# EAGLE design telem_board (EAGLE 6.5.0)
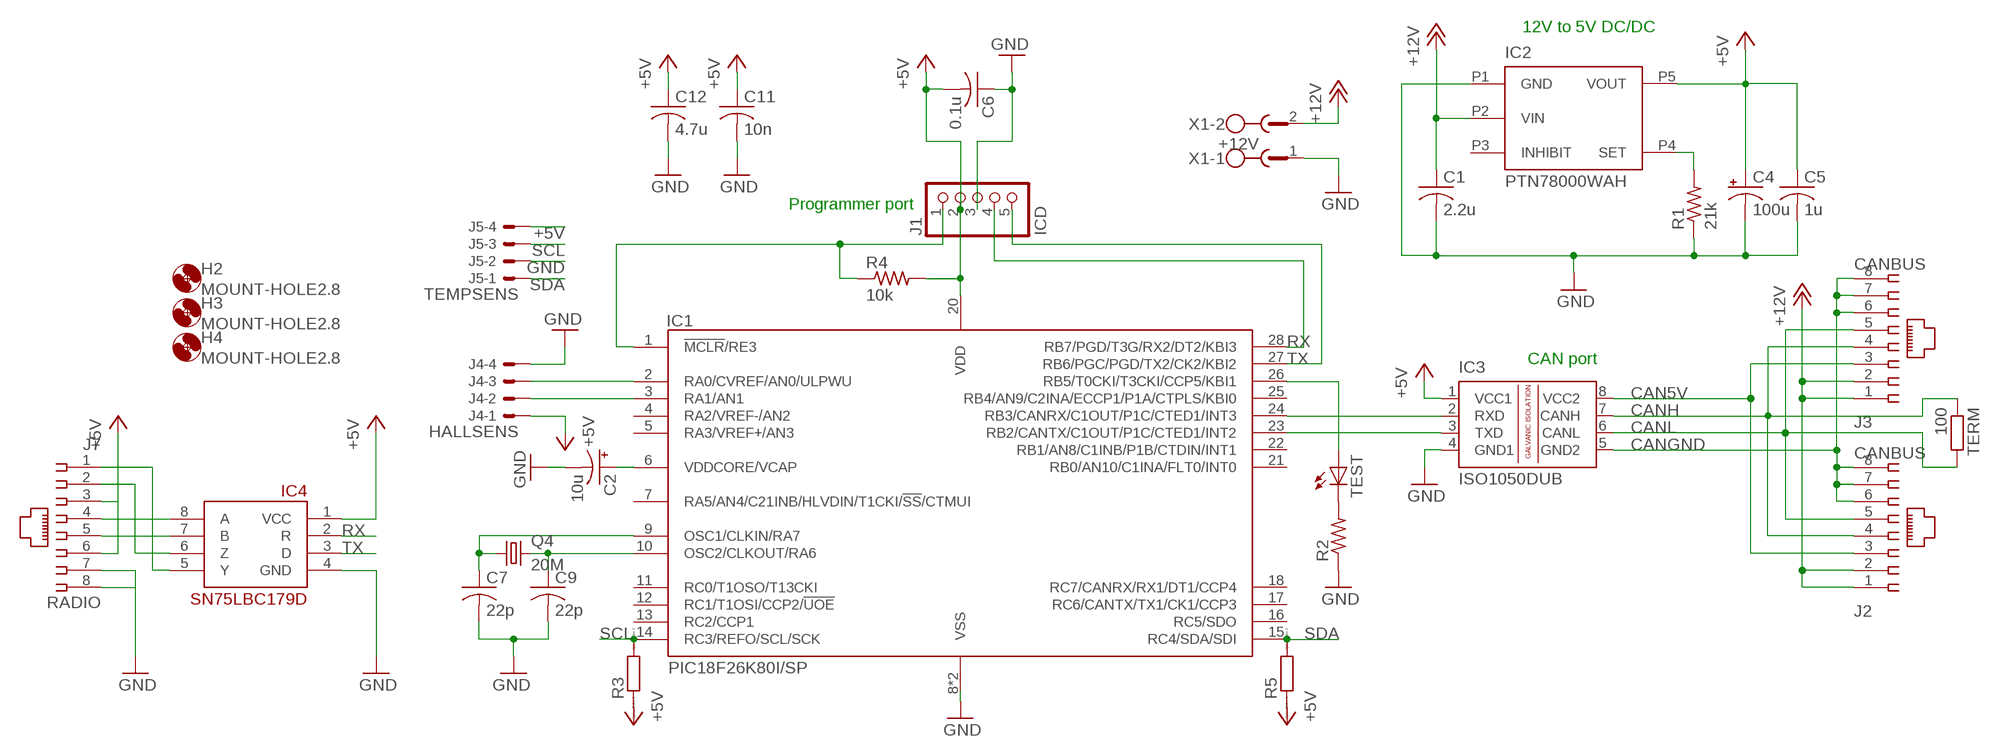
[diagram p0: schematic, sheet 1]

## Parts
C1  2.2u  C-USC1206  [C1206]
C2  10u  CPOL-USTT2D4  [TT2D4]
C4  100u  CPOL-USSMCD  [SMC_D]
C5  1u  C-USC0805  [C0805]
C6  0.1u  C-USC0805  [C0805]
C7  22p  C-USC0805  [C0805]
C9  22p  C-USC0805  [C0805]
C11  10n  C-USC0805  [C0805]
C12  4.7u  C-USC0805  [C0805]
H2  MOUNT-HOLE2.8  [2,8]
H3  MOUNT-HOLE2.8  [2,8]
H4  MOUNT-HOLE2.8  [2,8]
IC1  PIC18F26K80I/SP  [DIL28/3]
IC2  PTN78000WAH  [PTN78000]
IC3  ISO1050DUB  [DUB-R-PDSO-G8]
IC4  SN75LBC179D  [SO08]
J1  ICD  PINHD-1X5  [1X05]
J2  CANBUS  215877-7  [215877-7]
J3  CANBUS  215877-7  [215877-7]
J4  HALLSENS  22-27-2041-04  [6410-04]
J5  TEMPSENS  22-27-2041-04  [6410-04]
J7  RADIO  215877-7  [215877-7]
Q4  20M  CRYSTALHC49S  [HC49/S]
R1  21k  R-US_R0805  [R0805]
R2  R-US_R0805  [R0805]
R3  R  [R0805]
R4  10k  R-US_R0805  [R0805]
R5  R  [R0805]
TERM  100  R-EU_0207/10  [0207/10]
TEST  LED5MM  [LED5MM]
X1  +12V  MSTBA2  [MSTBA2]

## Nets
+5V: C4.+ C5.1 C6.2 C11.1 C12.1 IC1.20(VDD) IC2.P5(VOUT) IC3.1(VCC1) IC4.1(VCC) J1.2 J4.1 J5.4 J7.3 J7.6 R3.1 R4.2 R5.1
+12V: C1.1 IC2.P2(VIN) J2.1 J2.2 J3.1 J3.2 X1.2
CAN5V: IC3.8(VCC2) J2.3 J3.3
CANGND: IC3.5(GND2) J2.6 J2.7 J2.8 J3.6 J3.7 J3.8
CANH: IC3.7(CANH) J2.4 J3.4 TERM.1
CANL: IC3.6(CANL) J2.5 J3.5 TERM.2
GND: C1.2 C2.- C4.- C5.2 C6.1 C7.2 C9.2 C11.2 C12.2 IC1.8(VSS) IC1.19(VSS) IC2.P1(GND) IC3.4(GND1) IC4.4(GND) J1.3 J4.4 J5.2 J7.7 J7.8 R1.1 R2.1 X1.1
N$1: IC1.2(RA0/CVREF/AN0/ULPWU) J4.3
N$2: IC1.3(RA1/AN1) J4.2
N$3: IC4.7(B) J7.5
N$4: IC4.8(A) J7.4
N$5: C2.+ IC1.6(VDDCORE/VCAP)
N$6: IC1.23(RB2/CANTX/C1OUT/P1C/CTED1/INT2) IC3.3(TXD)
N$7: R2.2 TEST.K(C)
N$8: IC2.P4(SET) R1.2
N$9: IC1.24(RB3/CANRX/C1OUT/P1C/CTED1/INT3) IC3.2(RXD)
N$10: IC4.6(Z) J7.2
N$11: IC1.26(RB5/T0CKI/T3CKI/CCP5/KBI1) TEST.A
N$12: IC4.5(Y) J7.1
N$20: IC1.1(!MCLR!/RE3) J1.1 R4.1
N$24: C7.1 IC1.9(OSC1/CLKIN/RA7) Q4.1
N$25: C9.1 IC1.10(OSC2/CLKOUT/RA6) Q4.2
RX: IC1.28(RB7/PGD/T3G/RX2/DT2/KBI3) IC4.2(R) J1.4
SCL: IC1.14(RC3/REFO/SCL/SCK) J5.3 R3.2
SDA: IC1.15(RC4/SDA/SDI) J5.1 R5.2
TX: IC1.27(RB6/PGC/PGD/TX2/CK2/KBI2) IC4.3(D) J1.5
Unconnected: IC1.4(RA2/VREF-/AN2) IC1.5(RA3/VREF+/AN3) IC1.7(RA5/AN4/C21INB/HLVDIN/T1CKI/!SS!/CTMUI) IC1.11(RC0/T1OSO/T13CKI) IC1.12(RC1/T1OSI/CCP2/!UOE!) IC1.13(RC2/CCP1) IC1.16(RC5/SDO) IC1.17(RC6/CANTX/TX1/CK1/CCP3) IC1.18(RC7/CANRX/RX1/DT1/CCP4) IC1.21(RB0/AN10/C1INA/FLT0/INT0) IC1.22(RB1/AN8/C1INB/P1B/CTDIN/INT1) IC1.25(RB4/AN9/C2INA/ECCP1/P1A/CTPLS/KBI0) IC2.P3(INHIBIT)

## Notes on the sheet
- 12V to 5V DC/DC
- Programmer port
- CAN port

## Library data of the parts
C1 C5-C7 C9 = rcl:C-US: CAPACITOR, American symbol
C2 C4 = rcl:CPOL-US: POLARIZED CAPACITOR, American symbol
C11 C12 = resistor:C-US: CAPACITOR, American symbol
H2-H4 = holes:MOUNT-HOLE: MOUNTING HOLE with drill center marker
IC1 = MSCP_2011_v2:PIC18F26K80
IC2 = MSCP_2011_v1:PTN78000WAH
IC3 = texas:ISO1050: ISOLATED CAN TRANSCEIVER Source: http://focus.ti.com/lit/ds/symlink/iso1050.pdf; MPN: ISO1050DUBR; OC_FARNELL: 1755712; OC_NEWARK: 14R9899
IC4 = MSCP_2011_v1:SN75LBC179
J1 = pinhead:PINHD-1X5: PIN HEADER
J2 J3 J7 = con-amp:215877-7: AMP connector
J4 J5 = con-molex:22-?-04: CONNECTOR wire to board 2.54 mm (.1 inch) pitch header; OC_FARNELL: unknown; OC_NEWARK: unknown
Q4 = crystal:CRYSTAL: CRYSTAL; OC_FARNELL: 1667008; OC_NEWARK: unknown
R1 R4 = rcl:R-US_: RESISTOR, American symbol
R2 = adafruit:R-US_: RESISTOR, American symbol
R3 R5 = eagle-ltspice:R: RESISTOR, European symbol; SPICEMODEL: NONE; SPICEPREFIX: R
TERM = resistor:R-EU_: RESISTOR, European symbol
TEST = led:LED: LED OSRAM: - CHIPLED LG R971, LG N971, LY N971, LG Q971, LY Q971, LO R971, LY R971 LH N974, LH R974 LS Q976, LO Q976, LY Q976 LO Q996 - Hyper CHIPLED LW Q18S LB Q993, LB Q99A, LB R99A - SideLED LS A670, LO A670, LY A670, LG A670, LP A670 LB A673, LV A673, LT A673, LW A673 LH A674 LY A675 LS A676, LA A676, LO A676, LY A676, LW A676 LS A679, LY A679, LG A679 - Hyper Micro SIDELED® LS Y876, LA Y876, LO Y876, LY Y876 LT Y87S - SmartLED LW L88C, LW L88S LB L89C, LB L89S, LG L890 LS L89K, LO L89K, LY L89K LS L896, LA L896, LO L896, LY L896 - TOPLED LS T670, LO T670, LY T670, LG T670, LP T670 LSG T670, LSP T670, LSY T670, LOP T670, LYG T670 LG T671, LOG T671, LSG T671 LB T673, LV T673, LT T673, LW T673 LH T674 LS T676, LA T676, LO T676, LY T676, LB T676, LH T676, LSB T676, LW T676 LB T67C, LV T67C, LT T67C, LS T67K, LO T67K, LY T67K, LW E67C LS E67B, LA E67B, LO E67B, LY E67B, LB E67C, LV E67C, LT E67C LW T67C LS T679, LY T679, LG T679 LS T770, LO T770, LY T770, LG T770, LP T770 LB T773, LV T773, LT T773, LW T773 LH T774 LS E675, LA E675, LY E675, LS T675 LS T776, LA T776, LO T776, LY T776, LB T776 LHGB T686 LT T68C, LB T68C - Hyper Mini TOPLED® LB M676 - Mini TOPLED Santana® LG M470 LS M47K, LO M47K, LY M47K Source: http://www.osram.convergy.de LUXEON: - LUMILED® LXK2-PW12-R00, LXK2-PW12-S00, LXK2-PW14-U00, LXK2-PW14-V00 LXK2-PM12-R00, LXK2-PM12-S00, LXK2-PM14-U00 LXK2-PE12-Q00, LXK2-PE12-R00, LXK2-PE12-S00, LXK2-PE14-T00, LXK2-PE14-U00 LXK2-PB12-K00, LXK2-PB12-L00, LXK2-PB12-M00, LXK2-PB14-N00, LXK2-PB14-P00, LXK2-PB14-Q00 LXK2-PR12-L00, LXK2-PR12-M00, LXK2-PR14-Q00, LXK2-PR14-R00 LXK2-PD12-Q00, LXK2-PD12-R00, LXK2-PD12-S00 LXK2-PH12-R00, LXK2-PH12-S00 LXK2-PL12-P00, LXK2-PL12-Q00, LXK2-PL12-R00 Source: www.luxeon.com KINGBRIGHT: KA-3528ASYC Source: www.kingbright.com
X1 = con-phoenix-508:MSTBA2: PHOENIX; MF: FARNELL; MPN: 1757242; OC_FARNELL: 3705171; OC_NEWARK: 71C4161

## Board
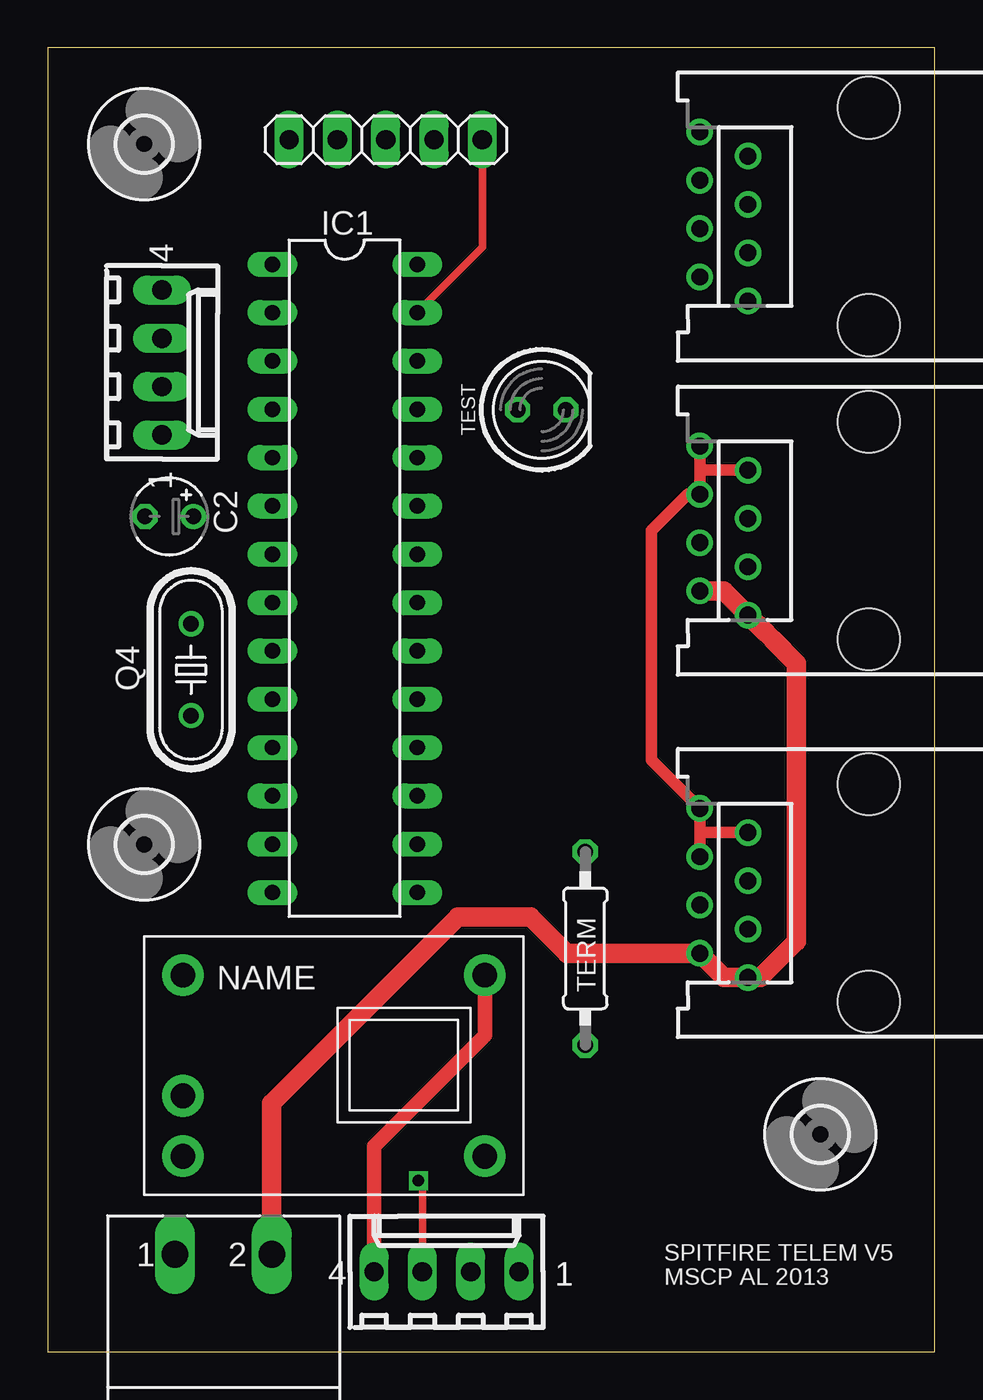
[diagram p1: board, top side]
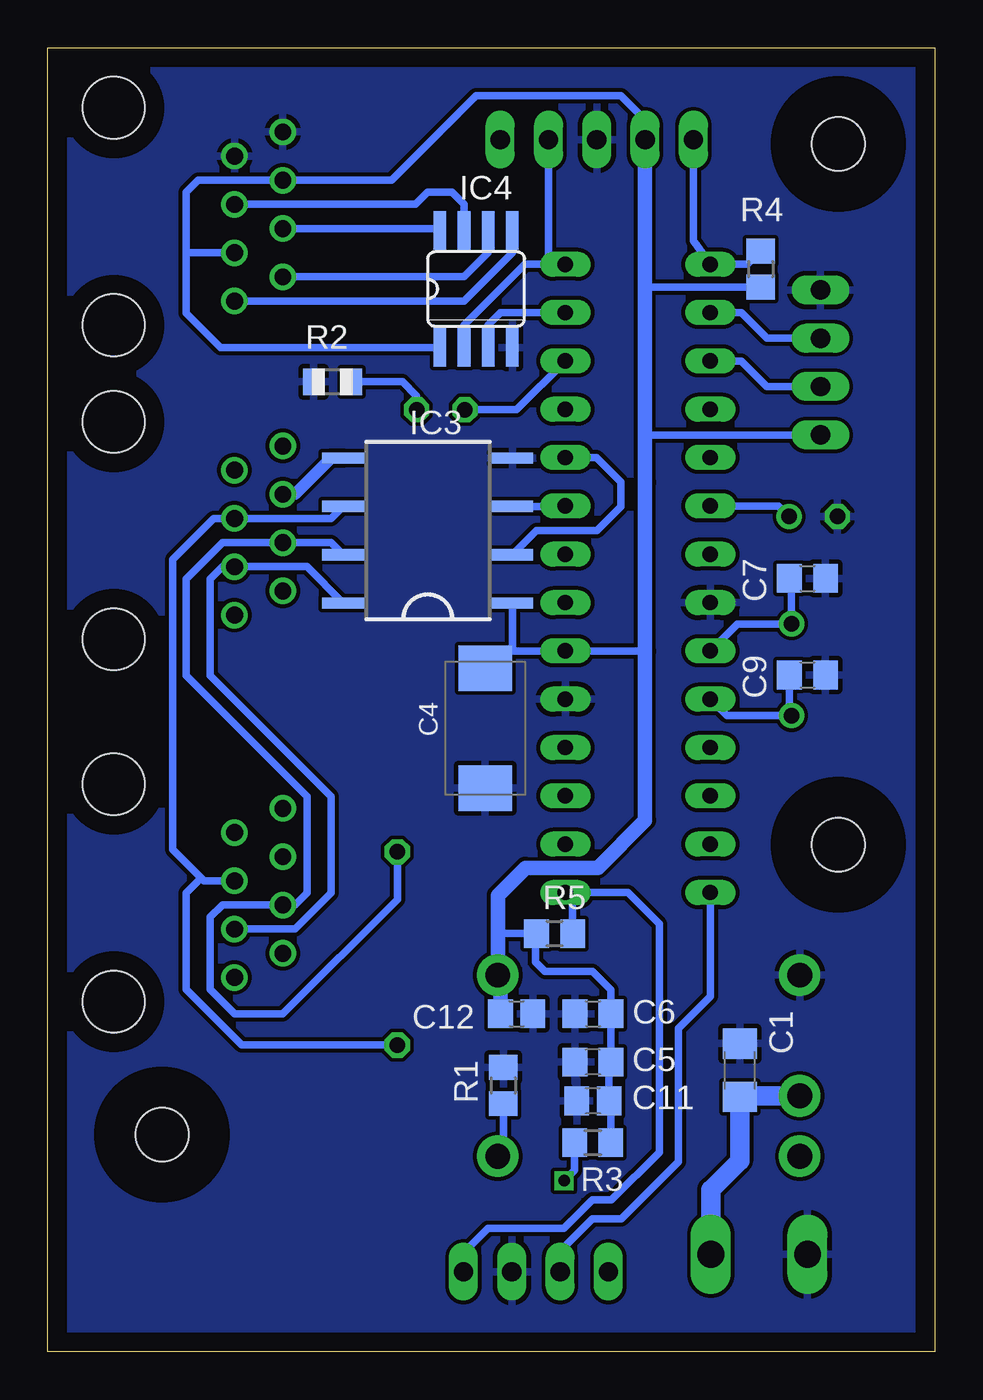
[diagram p2: board, bottom side, seen from below]

Size 46.66 x 68.57 mm. Coordinates in mm from the lower left corner, seen from the top.
Outline: 0,0 46.66,0 46.66,68.57 0,68.57 0,0
Copper layers (1*16): Top 0.035mm / dielectric 1.5mm / Bottom 0.035mm
Design rules "default": minimum track width 10mil, minimum drill 24mil, track to track 8mil, track to pad 8mil, pad to pad 8mil, via to via 8mil, smd to smd 8mil, copper to edge 40mil, drill to drill 8mil, minimum pad ring 10mil, minimum via ring 8mil, stop-mask expansion 4mil, vias tented up to drill 0mil, thermal gap 10mil

### Footprints (pad centres in the part's own frame; a part is rotated, then mirrored left to right if it is on the bottom)
C1206 = smd 1.6 x 1.8: 1 -1.4,0; 2 1.4,0
TT2D4 = drill 0.813: + -1.27,0 | drill 0.813 octagon: - 1.27,0
SMC_D = smd 2.4 x 2.8: + -3.15,0; - 3.15,0
C0805 = smd 1.3 x 1.5: 1 -0.95,0; 2 0.95,0
C0805' = smd 1.3 x 1.5: 1 -0.85,0; 2 0.85,0
2,8 = hole 2.8: 0,0
DIL28/3 = drill 0.813 long: 1 -16.51,-3.81; 2 -13.97,-3.81; 3 -11.43,-3.81; 4 -8.89,-3.81; 5 -6.35,-3.81; 6 -3.81,-3.81; 7 -1.27,-3.81; 8 1.27,-3.81; 9 3.81,-3.81; 10 6.35,-3.81; 11 8.89,-3.81; 12 11.43,-3.81; 13 13.97,-3.81; 14 16.51,-3.81; 15 16.51,3.81; 16 13.97,3.81; 17 11.43,3.81; 18 8.89,3.81; 19 6.35,3.81; 20 3.81,3.81; 21 1.27,3.81; 22 -1.27,3.81; 23 -3.81,3.81; 24 -6.35,3.81; 25 -8.89,3.81; 26 -11.43,3.81; 27 -13.97,3.81; 28 -16.51,3.81
PTN78000 = drill 1.3 pad 2.184: P1 -8.128,4.572; P2 -8.128,-1.778; P3 -8.128,-4.953; P4 7.747,-4.953; P5 7.747,4.572
DUB-R-PDSO-G8 = smd 0.6 x 2.2: 1 -3.81,-4.445; 2 -1.27,-4.445; 3 1.27,-4.445; 4 3.81,-4.445; 5 3.81,4.445; 6 1.27,4.445; 7 -1.27,4.445; 8 -3.81,4.445
SO08 = smd 0.66 x 2.032: 1 -1.905,-3.073; 2 -0.635,-3.073; 3 0.635,-3.073; 4 1.905,-3.073; 5 1.905,3.073; 6 0.635,3.073; 7 -0.635,3.073; 8 -1.905,3.073
1X05 = drill 1.016 long: 1 -5.08,0; 2 -2.54,0; 3 0,0; 4 2.54,0; 5 5.08,0
215877-7 = drill 0.889: 1 -4.445,6.35; 2 -3.175,8.89; 3 -1.905,6.35; 4 -0.635,8.89; 5 0.635,6.35; 6 1.905,8.89; 7 3.175,6.35; 8 4.445,8.89 | hole 3.251: -5.715,0; 5.715,0
6410-04 = drill 1.016 long: 1 3.81,0; 2 1.27,0; 3 -1.27,0; 4 -3.81,0
HC49/S = drill 0.813: 1 -2.413,0; 2 2.413,0
R0805 = smd 1.3 x 1.5: 1 -0.95,0; 2 0.95,0
R0805' = smd 1.1 x 1.4: 1 -1,0; 2 1,0
0207/10 = drill 0.813 octagon: 1 -5.08,0; 2 5.08,0
LED5MM = drill 0.813 octagon: A -1.27,0; K 1.27,0
MSTBA2 = drill 1.397 long: 1 -2.54,5.08; 2 2.54,5.08

### Placement (x,y rotation side)
C1  10.26,14.81 90 bottom
C2  6.4,43.92 180 top
C4  23.65,32.79 270 bottom
C5  17.98,15.24 180 bottom
C6  17.98,17.78 0 bottom
C7  6.71,40.67 0 bottom
C9  6.71,35.59 0 bottom
C11  10n  [C0805']  17.98,13.2 180 bottom
C12  4.7u  [C0805']  22,17.78 0 bottom
H2  5.08,26.67 0 top
H3  5.08,63.5 0 top
H4  40.64,11.43 0 top
IC1  15.62,40.67 270 top
IC2  15.24,15.24 0 top
IC3  26.67,43.18 90 bottom
IC4  24.13,55.88 0 bottom
J1  17.78,63.73 0 top
J2  43.18,43.18 90 top
J3  43.18,24.13 90 top
J4  6.02,52.02 270 top
J5  20.98,4.22 0 top
J7  43.18,59.69 90 top
Q4  7.54,35.86 270 top
R1  22.7,14 270 bottom
R2  [R0805']  31.67,51 0 bottom
R3  18,11 180 bottom
R4  9.17,56.92 270 bottom
R5  20,22 0 bottom
TERM  28.27,21.21 270 top
TEST  25.98,49.53 0 top
X1  9.25,0.05 0 top

### Tracks (layer width: path | path; a pad name or v marks a point on that pad's centre or on a via)
+5V
  Top 0.406: 22.86,16.51 22.99,16.64
  Top 0.762: J5.4 17.17,10.82 22.86,16.51 | 22.99,16.64 IC2.P5
  Bottom 0.406: 15.24,36.83 15.27,36.85 IC1.20 | 15.19,45.67 15.24,45.72 | R4.2 15.15,55.97 15.24,55.88 | J4.1 15.19,48.21 15.24,48.26 | C12.1 22.99,17.92 | IC1.20 19.71,36.85 | IC4.1 37.57,52.81 39.37,54.61 39.37,57.78 | 39.37,57.78 39.37,60.96 38.73,61.59 J7.6 28.57,61.59 24.13,66.04 16.51,66.04 15.24,64.77 J1.2 | J7.3 39.37,57.78 | C4.+ 22.73,36.85 22.23,36.85 | 22.23,36.85 IC1.20 | IC3.1 22.23,36.85 | 22.99,22 R5.1 21,21.95 21,20.5 20.5,20 18,20 17.03,19.03 C6.2 C5.1 17.13,15.14 C11.1 17.05,13.12 R3.1
  Bottom 0.762: J1.2 15.24,55.88 15.24,48.26 15.24,45.72 15.24,36.83 15.24,27.94 17.73,25.45 21.54,25.45 22.99,24 22.99,22 IC2.P5 22.85,19.67 C12.1
+12V
  Top 1.016: X1.2 11.79,13.06 21.59,22.86 25.4,22.86 27.3,20.95 J3.2 35.56,19.68 J3.1 37.47,19.68 39.37,21.59 39.37,36.2 38.1,37.47 37.78,37.78 J2.1 35.56,40.01 J2.2
  Bottom 1.016: IC2.P2 10.21,13.46 C1.1 10.26,10.06 11.79,8.53 X1.2
CAN5V
  Bottom 0.406: IC3.8 33.02,41.27 J2.3 37.47,41.27 38.1,40.64 38.1,35.56 31.75,29.21 31.75,24.13 33.66,22.23 J3.3
CANGND
  Top 0.61: 34.29,27.3 J3.8 31.75,31.11 31.75,43.18 33.66,45.09 J2.6 34.29,46.35 | J3.7 34.29,27.3 | 34.29,27.3 J3.6 | J2.8 34.29,46.35 | J2.7 34.29,46.35
  Bottom 0.61: IC3.5 31.75,46.99 33.66,45.09 J2.6
CANH
  Bottom 0.406: IC3.7 31.75,42.55 J2.4 37.47,42.55 39.37,40.64 39.37,35.56 33.02,29.21 33.02,24.13 33.66,23.5 J3.4 37.47,23.5 38.1,22.86 38.1,19.05 36.83,17.78 34.29,17.78 28.27,23.8 TERM.1
CANL
  Bottom 0.406: IC3.6 31.75,43.81 J2.5 37.92,43.81 40.08,41.66 40.08,26.42 38.58,24.92 | J3.5 38.43,24.77 38.58,24.92 | TERM.2 36.45,16.13 39.37,19.05 39.37,24.13 38.58,24.92
GND
  pour Bottom: -1.27,-1.27 48.26,-1.27 48.26,68.58 -1.27,68.58
N$1
  Bottom 0.406: J4.3 8.84,53.29 10.19,54.63 IC1.2
N$2
  Bottom 0.406: J4.2 8.84,50.75 10.19,52.09 IC1.3
N$3
  Bottom 0.406: J7.5 27.3,60.33 26.67,60.96 25.4,60.96 24.77,60.33 IC4.7
N$4
  Bottom 0.406: J7.4 26.14,59.05 IC4.8
N$5
  Bottom 0.406: IC1.6 8.23,44.48 C2.+
N$6
  Bottom 0.406: IC3.3 19.46,44.45 IC1.23
N$7
  Bottom 0.406: R2.2 28,51 27.25,50.25 TEST.K
N$8
  Bottom 0.406: R1.2 22.7,10.57 IC2.P4
N$9
  Bottom 0.406: IC1.24 17.8,47.02 16.51,45.72 16.51,44.45 17.78,43.18 20.95,43.18 IC3.2
N$10
  Bottom 0.406: J7.2 24.77,56.52 23.5,57.78 IC4.6
N$11
  Bottom 0.406: TEST.A 22,49.53 IC1.26
N$12
  Bottom 0.406: J7.1 24.77,55.24 22.23,57.78 IC4.5
N$20
  Bottom 0.406: J1.1 12.7,58.42 IC1.1 9.87,57.17 R4.1
N$24
  Bottom 0.406: IC1.9 10.39,38.28 Q4.1 7.54,40.55 C7.1
N$25
  Bottom 0.406: IC1.10 10.95,33.45 Q4.2 7.66,33.56 C9.1
RX
  Bottom 0.406: IC1.28 20.32,57.17 | 20.32,57.17 21.57,57.17 24.77,53.98 IC4.2 | J1.4 20.32,57.17
SCL  (via drill 0.6)
  Top 0.406: J5.3 19.71,8.79 v19.5,9
  Bottom 0.406: IC1.14 11.81,18.69 13.5,17 13.5,10 16.5,7 18,7 19.71,5.29 J5.3 | v19.5,9 18.95,9.55 R3.2
SDA
  Bottom 0.406: J5.1 24.79,5.21 23.5,6.5 19.5,6.5 18,8 17,8 14.5,10.5 14.5,22.5 16.16,24.16 IC1.15 19.05,23.77 R5.2
TX
  Top 0.406: J1.5 22.86,58.06 IC1.27
  Bottom 0.406: IC1.27 22.84,54.63 23.5,53.98 IC4.3

### Text on the board
tPlace: SPITFIRE TELEM V5 | MSCP AL 2013